# Altium schematic sheet i2c.SchDoc
size A
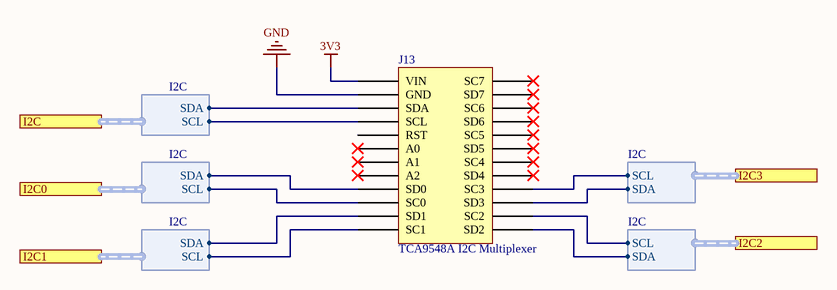
[diagram p0: i2c.SchDoc]

## Parts
J13  TCA9548A I2C Multiplexer  [TCA9548A I2C Multiplexer]

## Ports
I2C0 (harness I2C), I2C1 (harness I2C), I2C2 (harness I2C), I2C3 (harness I2C), I2C (harness I2C)

## Harnesses
I2C: SDA, SCL

## Nets
3V3: J13.1(VIN)
GND: J13.2(GND)
NetJ13_3: J13.3(SDA) ; port I2C.SDA
NetJ13_4: J13.4(SCL) ; port I2C.SCL
NetJ13_9: J13.9(SD0) ; port I2C0.SDA
NetJ13_10: J13.10(SC0) ; port I2C0.SCL
NetJ13_11: J13.11(SD1) ; port I2C1.SDA
NetJ13_12: J13.12(SC1) ; port I2C1.SCL
NetJ13_13: J13.13(SD2) ; port I2C2.SDA
NetJ13_14: J13.14(SC2) ; port I2C2.SCL
NetJ13_15: J13.15(SD3) ; port I2C3.SDA
NetJ13_16: J13.16(SC3) ; port I2C3.SCL

Not connected (* = marked no-connect by the designer): J13 5(RST) 6(A0)* 7(A1)* 8(A2)* 17(SD4)* 18(SC4)* 19(SD5)* 20(SC5)* 21(SD6)* 22(SC6)* 23(SD7)* 24(SC7)*